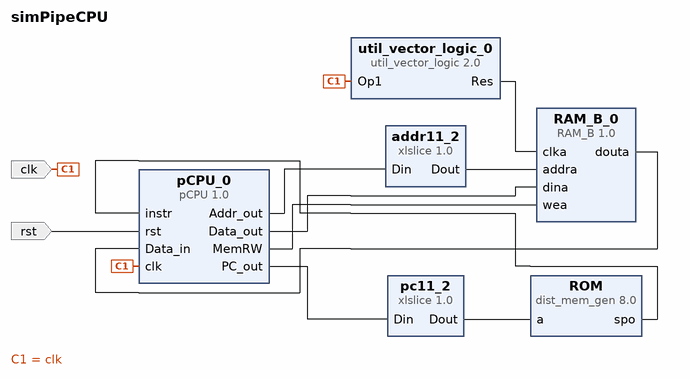
[diagram p0: block diagram of the top level]
# Vivado block design simPipeCPU, xc7k160tffg676-2L, Vivado 2020.2
create_bd_design simPipeCPU

create_bd_port -dir I -type clk clk
create_bd_port -dir I -type rst rst
set_property -dict {CONFIG.POLARITY ACTIVE_HIGH} [get_bd_ports rst]

create_bd_cell -type ip -vlnv xilinx.com:ip:dist_mem_gen:8.0 ROM
set_property -dict [list \
  CONFIG.coefficient_file ../../../../../../../h.coe \
  CONFIG.data_width 32 \
  CONFIG.depth 1024 \
  CONFIG.memory_type rom \
] [get_bd_cells ROM]
create_bd_cell -type ip -vlnv xilinx.com:ip:xlslice:1.0 pc11_2
set_property -dict {CONFIG.DIN_FROM 11 CONFIG.DIN_TO 2 CONFIG.DOUT_WIDTH 10} [get_bd_cells pc11_2]
create_bd_cell -type ip -vlnv xilinx.com:ip:xlslice:1.0 addr11_2
set_property -dict {CONFIG.DIN_FROM 11 CONFIG.DIN_TO 2 CONFIG.DOUT_WIDTH 10} [get_bd_cells addr11_2]
create_bd_cell -type ip -vlnv xilinx.com:user:RAM_B:1.0 RAM_B_0
create_bd_cell -type ip -vlnv xilinx.com:ip:util_vector_logic:2.0 util_vector_logic_0
set_property -dict {CONFIG.C_OPERATION not CONFIG.C_SIZE 1} [get_bd_cells util_vector_logic_0]
create_bd_cell -type ip -vlnv xilinx.com:user:pCPU:1.0 pCPU_0

# ---- connections ----

connect_bd_net -net dist_mem_gen_0_spo [get_bd_pins ROM/spo] [get_bd_pins pCPU_0/instr]
connect_bd_net -net rst_0_1 [get_bd_ports rst] [get_bd_pins pCPU_0/rst]
connect_bd_net [get_bd_pins pc11_2/Dout] [get_bd_pins ROM/a]
connect_bd_net [get_bd_pins RAM_B_0/douta] [get_bd_pins pCPU_0/Data_in]
connect_bd_net [get_bd_pins addr11_2/Dout] [get_bd_pins RAM_B_0/addra]
connect_bd_net [get_bd_pins pCPU_0/Addr_out] [get_bd_pins addr11_2/Din]
connect_bd_net -net pCPU_0_PC [get_bd_pins pCPU_0/PC_out] [get_bd_pins pc11_2/Din]
connect_bd_net [get_bd_pins pCPU_0/Data_out] [get_bd_pins RAM_B_0/dina]
connect_bd_net [get_bd_ports clk] [get_bd_pins util_vector_logic_0/Op1] [get_bd_pins pCPU_0/clk]
connect_bd_net [get_bd_pins util_vector_logic_0/Res] [get_bd_pins RAM_B_0/clka]
connect_bd_net [get_bd_pins pCPU_0/MemRW] [get_bd_pins RAM_B_0/wea]

validate_bd_design
save_bd_design
